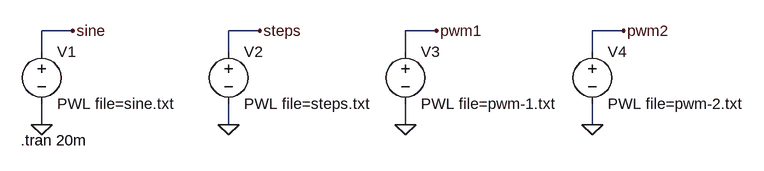
[diagram p0: schematic pwl-test.asc]
pwl-test.asc, the LTspice schematic file:
Version 4
SHEET 1 1400 680
WIRE 112 128 64 128
WIRE 400 128 352 128
WIRE 672 128 624 128
WIRE 960 128 912 128
WIRE 64 160 64 128
WIRE 352 160 352 128
WIRE 624 160 624 128
WIRE 912 160 912 128
WIRE 64 272 64 240
WIRE 352 272 352 240
WIRE 624 272 624 240
WIRE 912 272 912 240
FLAG 112 128 sine
FLAG 64 272 0
FLAG 400 128 steps
FLAG 352 272 0
FLAG 672 128 pwm1
FLAG 624 272 0
FLAG 960 128 pwm2
FLAG 912 272 0
SYMBOL voltage 64 144 R0
WINDOW 123 0 0 Left 0
WINDOW 39 0 0 Left 0
SYMATTR InstName V1
SYMATTR Value PWL file=sine.txt
SYMBOL voltage 352 144 R0
WINDOW 123 0 0 Left 0
WINDOW 39 0 0 Left 0
SYMATTR InstName V2
SYMATTR Value PWL file=steps.txt
SYMBOL voltage 624 144 R0
WINDOW 123 0 0 Left 0
WINDOW 39 0 0 Left 0
SYMATTR InstName V3
SYMATTR Value PWL file=pwm-1.txt
SYMBOL voltage 912 144 R0
WINDOW 123 0 0 Left 0
WINDOW 39 0 0 Left 0
SYMATTR InstName V4
SYMATTR Value PWL file=pwm-2.txt
TEXT 32 296 Left 2 !.tran 20m

The netlist it stands for:
* pwl-test.asc
V1 sine 0 PWL file=sine.txt
V2 steps 0 PWL file=steps.txt
V3 pwm1 0 PWL file=pwm-1.txt
V4 pwm2 0 PWL file=pwm-2.txt
.tran 20m
.backanno
.end